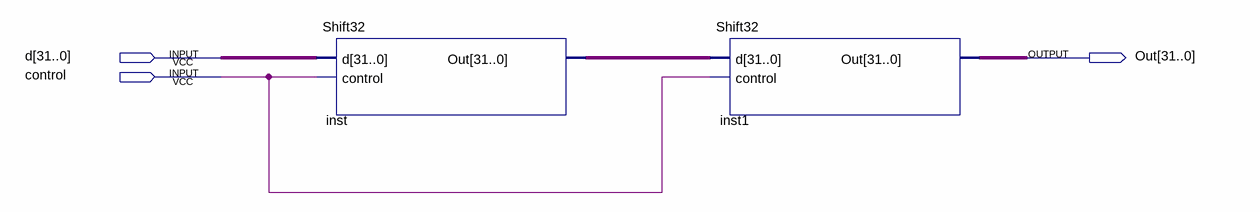
[diagram p0: schematic sheet]
// Quartus schematic Shift32Amt2.bdf as structural Verilog: 2 symbols, 3 pins
module Shift32Amt2 (
  input  [31:0] d,
  input  control,
  output [31:0] Out
);

  wire [31:0] inst_out;

  Shift32 inst (.d(d), .control(control), .Out(inst_out));
  Shift32 inst1 (.d(inst_out), .control(control), .Out(Out));
endmodule
